# EAGLE design SparkFun_5-Way_Tactile_Switch_Breakout (EAGLE 7.2.0)
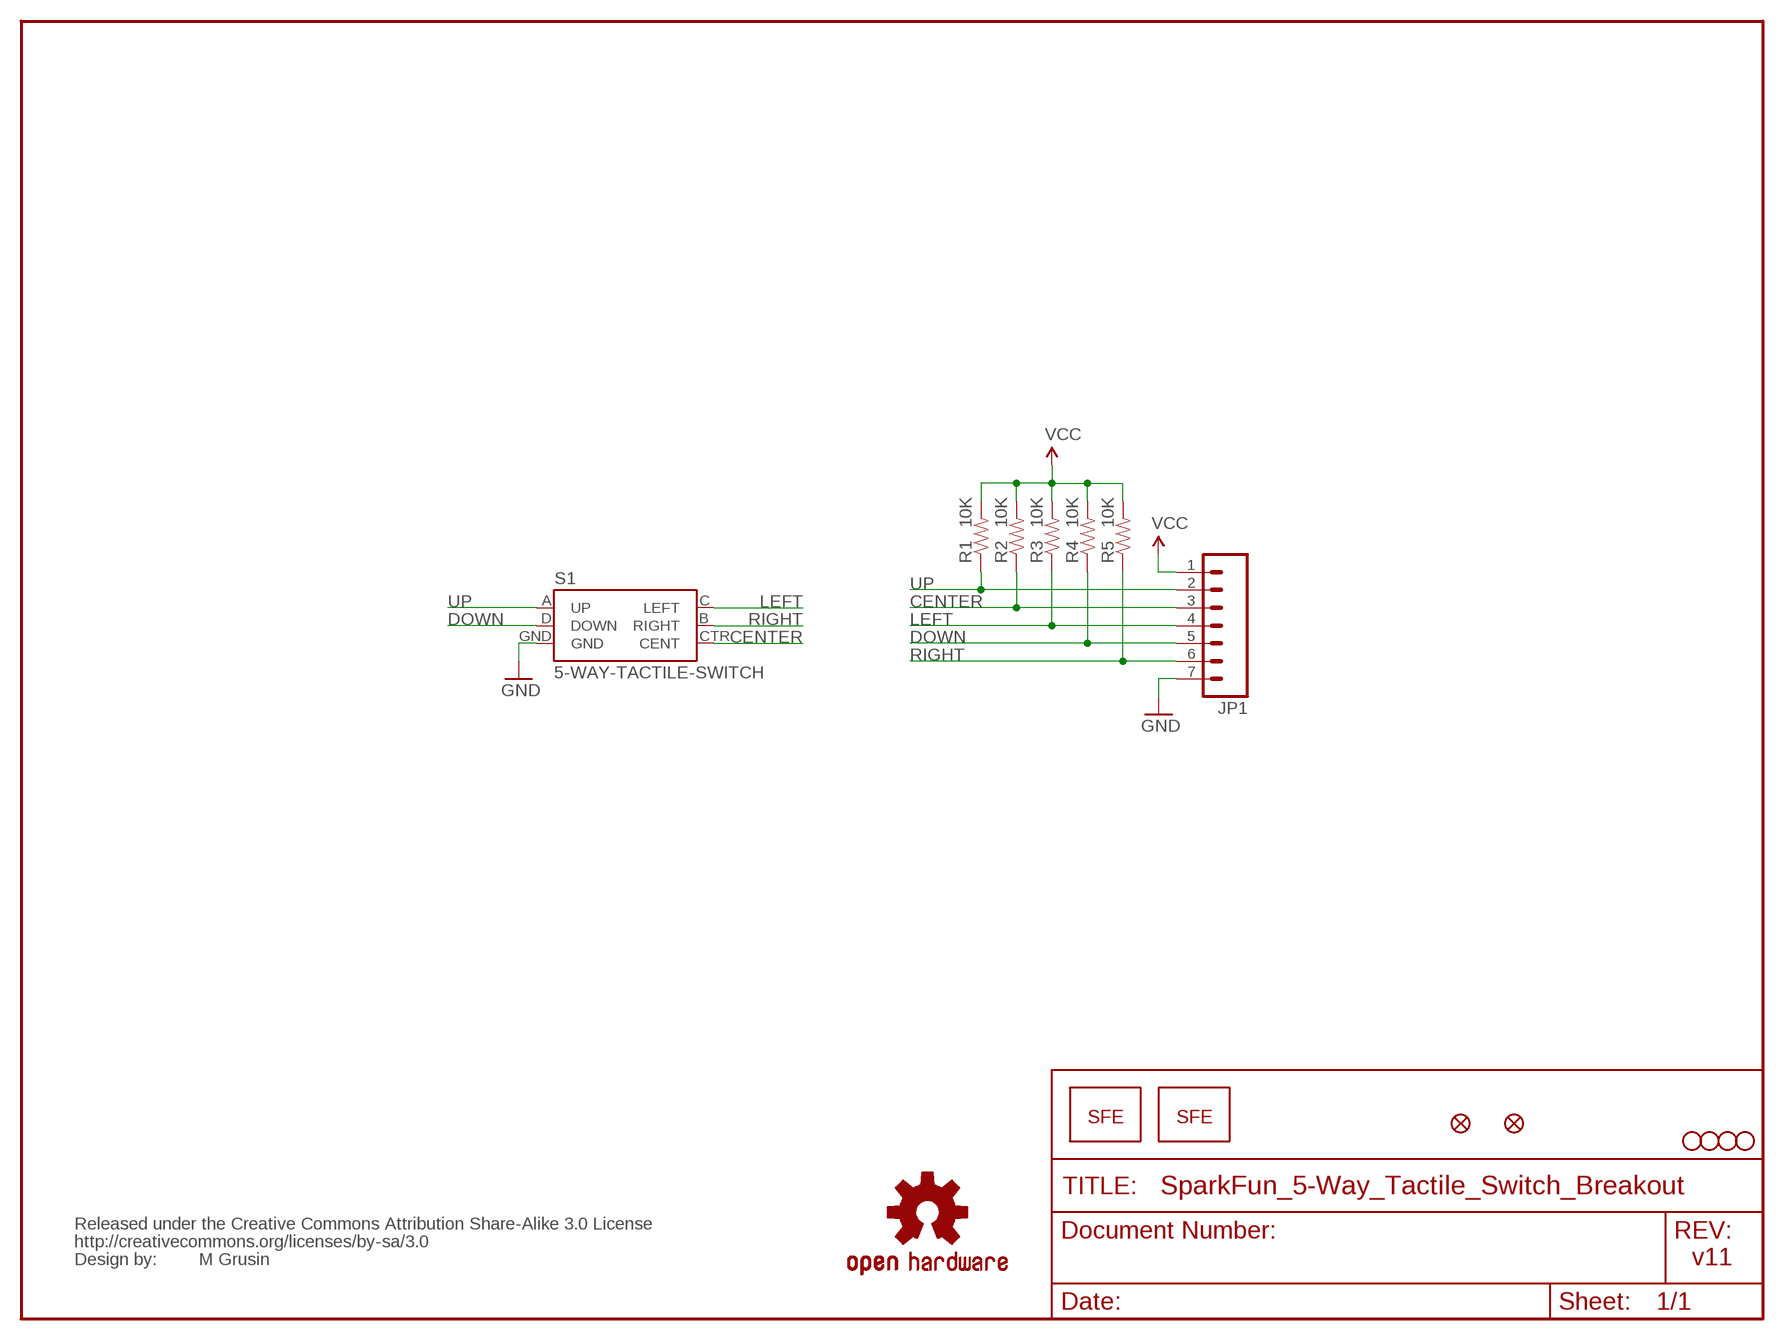
[diagram p0: schematic, sheet 1]

## Parts
JP1  M07  [1X07]
JP2  FIDUCIALUFIDUCIAL  [MICRO-FIDUCIAL]
JP3  STAND-OFF  [STAND-OFF]
JP4  STAND-OFF  [STAND-OFF]
JP5  STAND-OFF  [STAND-OFF]
JP6  STAND-OFF  [STAND-OFF]
JP7  FIDUCIALUFIDUCIAL  [MICRO-FIDUCIAL]
JP9  LOGO-SFESK  [SFE-LOGO-FLAME]
JP10  LOGO-SFENW2  [SFE-NEW-WEB]
R1  10K  RESISTOR0603-RES  [0603-RES]
R2  10K  RESISTOR0603-RES  [0603-RES]
R3  10K  RESISTOR0603-RES  [0603-RES]
R4  10K  RESISTOR0603-RES  [0603-RES]
R5  10K  RESISTOR0603-RES  [0603-RES]
S1  5-WAY-TACTILE-SWITCH  JOYSTICK_MINI  [JOYSTICK_MINI]
U$1  OSHW-LOGOS  [OSHW-LOGO-S]
U$2  CREATIVE_COMMONS  [CREATIVE_COMMONS]

## Nets
CENTER: JP1.3 R2.1 S1.CTR(CENT)
DOWN: JP1.5 R4.1 S1.D(DOWN)
GND: JP1.7 S1.GND
LEFT: JP1.4 R3.1 S1.C(LEFT)
RIGHT: JP1.6 R5.1 S1.B(RIGHT)
UP: JP1.2 R1.1 S1.A(UP)
VCC: JP1.1 R1.2 R2.2 R3.2 R4.2 R5.2

## Notes on the sheet
- M Grusin | v11

## Library data of the parts
JP1 = SparkFun:M07: Header 7 Standard 7-pin 0.1" header. Use with straight break away headers (SKU : PRT-00116), right angle break away headers (PRT-00553), swiss pins (PRT-00743), machine pins (PRT-00117), and female headers (PRT-00115). NOTES ON THE VARIANTS LOCK and LOCK_LONGPADS... This footprint was designed to help hold the alignment of a through-hole component (i.e. 7-pin header) while soldering it into place. You may notice that each hole has been shifted either up or down by 0.005 of an inch from it's more standard position (which is usually a perfectly straight line). This slight alteration caused the pins (the squares in the middle) to touch the edges of the holes. Because they are alternating, it causes a "brace" to hold the header in place. 0.005 has proven to be the perfect amount of "off-center" position when using our standard breakaway headers. Although looks a little odd when you look at the bare footprint, once you have a header in there, the alteration is very hard to notice. Also, if you push a header all the way into place, it is covered up entirely on the bottom side. This idea of altering the position of holes to aid alignment will be further integrated into the Sparkfun Library for other footprints. It can help hold any component with 3 or more connection pins.
JP2 JP7 = SparkFun:FIDUCIAL: Fiducial Alignment Points Various fiducial points for machine vision alignment.
JP3-JP6 = SparkFun:STAND-OFF: Stand Off This is the mechanical footprint for a #4 phillips button head screw. Use the keepout ring to avoid running the screw head into surrounding components. SKU : PRT-00447
JP9 JP10 = SparkFun:LOGO-SFE: Spark Fun Electronics PCB Logo This is the standard Spark Fun Electronics PCB logo.
R1-R5 = SparkFun:RESISTOR: Resistor Basic schematic elements and footprints for 0603, 1206, and PTH resistors.
S1 = SparkFun-Electromechanical:JOYSTICK_MINI: Small 5-way tactile joystick, COM-10063 4UCON SF303GJ26
U$1 = SparkFun:OSHW-LOGO: Open Source Hardware Logo This logo indicates the piece of hardware it is found on incorporates a OSHW license and/or adheres to the definition of open source hardware found here: http://freedomdefined.org/OSHW
U$2 = SparkFun:CREATIVE_COMMONS

## Board
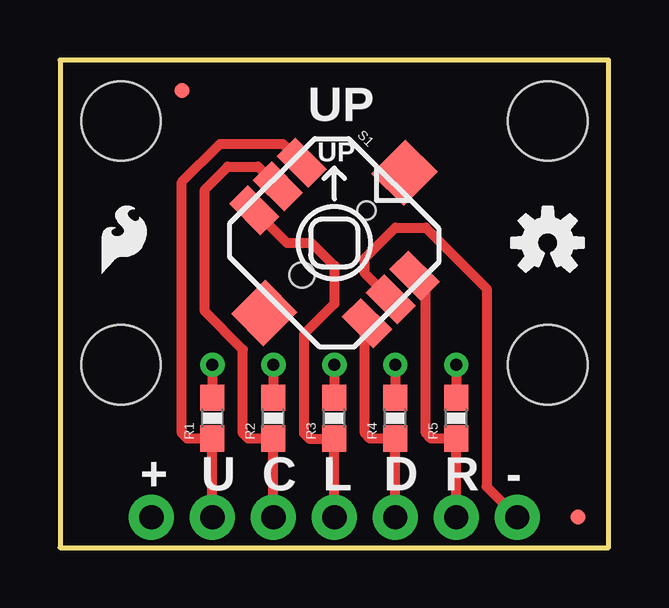
[diagram p1: board, top side]
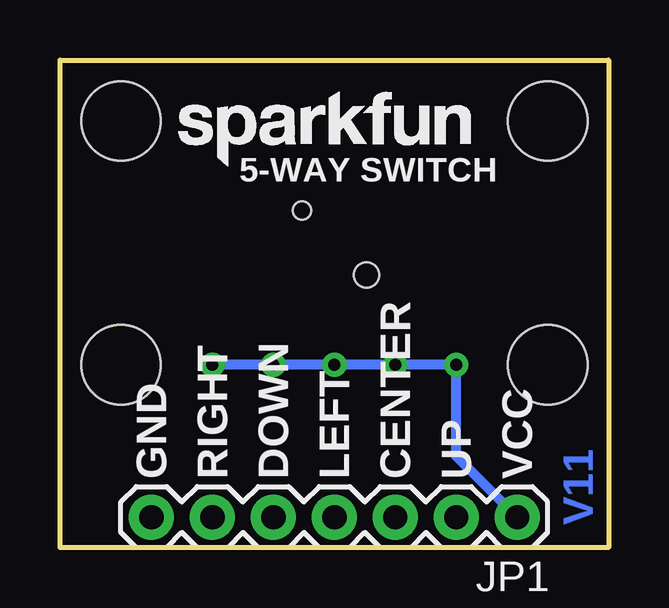
[diagram p2: board, bottom side, seen from below]

Size 22.86 x 20.32 mm. Coordinates in mm from the lower left corner, seen from the top.
Outline: 0,0 22.86,0 22.86,20.32 0,20.32 0,0
Copper layers (1*16): Top 0.035mm / dielectric 1.5mm / Bottom 0.035mm
Design rules "default": minimum track width 8mil, minimum drill 20mil, track to track 8mil, track to pad 8mil, pad to pad 8mil, via to via 8mil, smd to smd 8mil, copper to edge 8mil, drill to drill 8mil, minimum pad ring 12mil, minimum via ring 10mil, stop-mask expansion 4mil, vias tented up to drill 20mil, thermal gap 10mil

### Footprints (pad centres in the part's own frame; a part is rotated, then mirrored left to right if it is on the bottom)
1X07 = drill 1.016 pad 1.88: 1 0,0; 2 2.54,0; 3 5.08,0; 4 7.62,0; 5 10.16,0; 6 12.7,0; 7 15.24,0
MICRO-FIDUCIAL = smd 0.635 x 0.635: 1 0,0
STAND-OFF = hole 3.302: 0,0
0603-RES = smd 1.1 x 1: 1 -0.85,0; 2 0.85,0
JOYSTICK_MINI = smd 1.85 x 1.1: A -3.325,1.4; B 3.325,1.4; C -3.325,-1.4; CTR -3.325,0; D 3.325,-1.4; GND 3.325,0 | smd 1.9 x 2: NC 0,4.13; NC@0 0,-4.13 | hole 0.75: 0,1.9 | hole 1.05: 0,-1.9

### Placement (x,y rotation side)
JP1  3.81,1.27 180 bottom
JP2  21.59,1.27 0 top
JP3  20.32,17.78 0 top
JP4  20.32,7.62 0 top
JP5  2.54,17.78 0 top
JP6  2.54,7.62 0 top
JP7  5.08,19.05 0 top
JP9  1.75,11.43 0 top
JP10  17.94,15.88 0 bottom
R1  6.35,5.4 90 top
R2  8.89,5.4 90 top
R3  11.43,5.4 90 top
R4  13.97,5.4 90 top
R5  16.51,5.4 90 top
S1  11.43,12.7 315 top
U$1  20.32,12.7 0 top
U$2  -19.05,-12.7 0 top  (outside the outline)

### Tracks (layer width: path | path; a pad name or v marks a point on that pad's centre or on a via)
CENTER
  Top 0.406: S1.CTR 8.26,15.88 6.99,15.88 6.03,14.92 6.03,9.84 7.62,8.26 7.62,4.76 7.83,4.55 R2.1 JP1.3
DOWN
  Top 0.406: S1.D 12.7,9.27 12.7,4.76 12.91,4.55 R4.1 JP1.5
GND
  Top 0.406: S1.GND 12.7,11.43 12.7,12.06 13.97,13.34 15.24,13.34 17.78,10.79 17.78,2.54 JP1.7
LEFT
  Top 0.406: S1.C 9.45,12.7 10.48,12.7 11.43,11.75 11.43,10.16 10.16,8.89 10.16,4.76 10.38,4.55 R3.1 JP1.4
RIGHT
  Top 0.406: JP1.6 R5.1 15.46,4.55 15.24,4.76 15.24,10.87 S1.B
UP
  Top 0.406: S1.A 9.28,16.83 6.67,16.83 5.08,15.24 5.08,4.76 5.29,4.55 R1.1 JP1.2
VCC  (via drill 0.51)
  Top 0.406: v6.35,7.62 R1.2 | v8.89,7.62 R2.2 | v11.43,7.62 R3.2 | v13.97,7.62 R4.2 | v16.51,7.62 R5.2
  Bottom 0.406: JP1.1 6.35,3.81 v6.35,7.62 v8.89,7.62 v11.43,7.62 v13.97,7.62 v16.51,7.62

### Text on the board
Bottom: V11
tPlace: UP | + | U | C | L | D | R | -
bPlace: 5-WAY SWITCH | VCC | UP | CENTER | LEFT | DOWN | RIGHT | GND
tValues: M Grusin
Document: 0.00" | 0.10" | 0.15" | 0.45" | 0.80" | 0.90" | 0.80" | 0.70" | 0.50" | 0.30" | 0.05" | 0.00"